# EAGLE design schema (EAGLE 8.0.2)
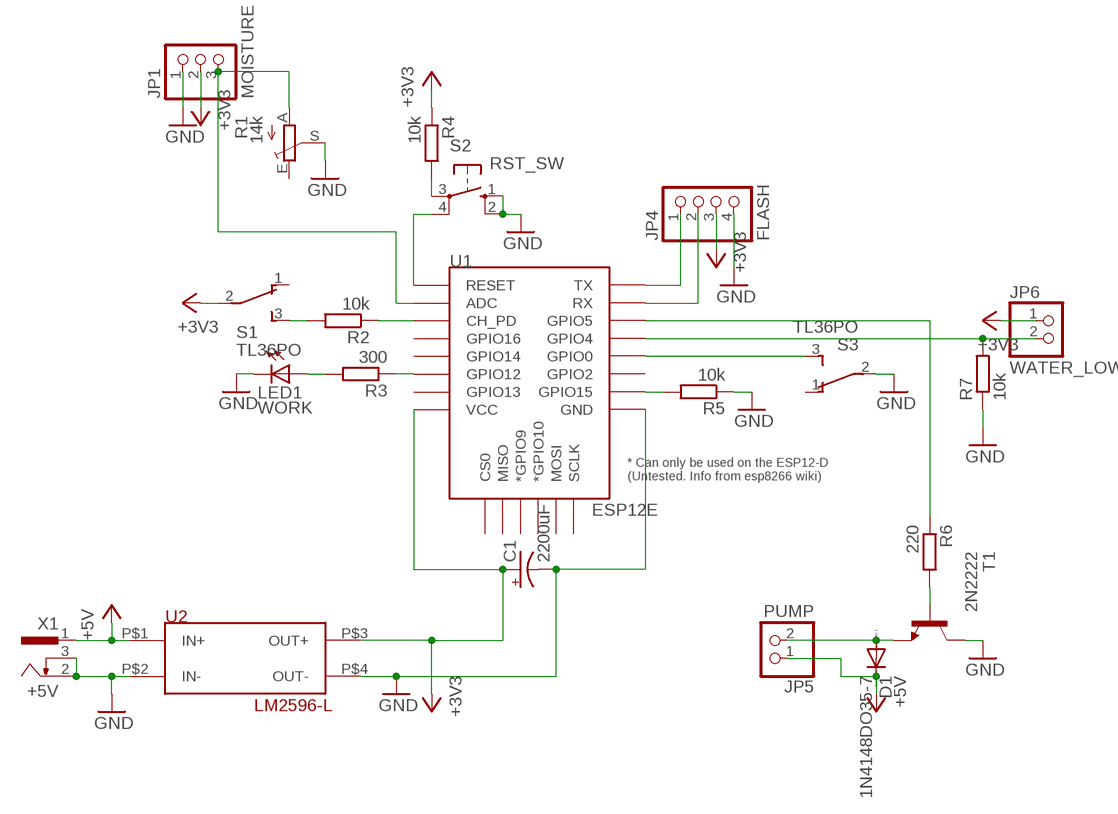
[diagram p0: schematic, sheet 1]

## Parts
C1  2200uF  100UF-25V-20%(PTH)  [CPOL-RADIAL-100UF-25V]
D1  1N4148DO35-7  [DO35-7]
JP1  MOISTURE  PINHD-1X3  [1X03]
JP4  FLASH  PINHD-1X4  [1X04]
JP5  PUMP  PINHD-1X2  [1X02]
JP6  WATER_LOW  PINHD-1X2  [1X02]
LED1  WORK  LED3MM  [LED3MM]
R1  14k  TRIM_EU-CA6V  [CA6V]
R2  10k  R-EU_0309/V  [0309V]
R3  300  R-EU_0309/V  [0309V]
R4  10k  R-EU_0309/V  [0309V]
R5  10k  R-EU_0309/V  [0309V]
R6  220  R-EU_0309/V  [0309V]
R7  10k  R-EU_0309/V  [0309V]
S1  TL36PO  [TL3XPO]
S2  RST_SW  10-XX  [B3F-10XX]
S3  TL36PO  [TL3XPO]
T1  2N2222  [TO18]
U1  ESP12E  ESP12ESMD  [ESP12E-SMD]
U2  LM2596-L  [LM2596-L]
X1  +5V  733989-5  [733989-5]

## Nets
+3V3: C1.1(+) JP1.2 JP4.3 JP6.1 R4.1 S1.2(P) U1.VCC U2.P$3(OUT+)
+5V: D1.C JP5.1 U2.P$1(IN+) X1.1
ADC: JP1.3 R1.A U1.ADC
CH_PD: R2.1 U1.CH_PD
CH_PD_S: R2.2 S1.3(S)
GND: C1.2(-) JP1.1 JP4.4 LED1.K(C) R1.S R5.1 R7.1 S2.1(S) S2.2(S1) S3.2(P) T1.3(C) U1.GND U2.P$2(IN-) U2.P$4(OUT-) X1.2 X1.3
GPIO0: S3.3(S) U1.GPIO0
GPIO4: JP6.2 R7.2 U1.GPIO4
GPIO5: R6.1 U1.GPIO5
GPIO5_T: R6.2 T1.2(B)
GPIO12: R3.1 U1.GPIO12
GPIO12D: LED1.A R3.2
GPIO15: R5.2 U1.GPIO15
PUMP_GND: D1.A JP5.2 T1.1(E)
RST: S2.4(P1) U1.RESET
RST_R: R4.2 S2.3(P)
RX: JP4.2 U1.RXD0(RX)
TX: JP4.1 U1.TXD0(TX)
Unconnected: R1.E S1.1(O) S3.1(O) U1.CS0 U1.GPIO2 U1.GPIO9(*GPIO9) U1.GPIO10(*GPIO10) U1.GPIO13 U1.GPIO14 U1.GPIO16 U1.MISO U1.MOSI U1.SCLK

## Library data of the parts
C1 = SparkFun-Capacitors:100UF-25V-20%(PTH): CAP-08439; PROD_ID: CAP-08439
D1 = diode:1N4148: DIODE high speed (Philips)
JP1 = pinhead:PINHD-1X3: PIN HEADER
JP4 = pinhead:PINHD-1X4: PIN HEADER
JP5 JP6 = pinhead:PINHD-1X2: PIN HEADER
LED1 = led:LED: LED OSRAM: - CHIPLED LG R971, LG N971, LY N971, LG Q971, LY Q971, LO R971, LY R971 LH N974, LH R974 LS Q976, LO Q976, LY Q976 LO Q996 - Hyper CHIPLED LW Q18S LB Q993, LB Q99A, LB R99A - SideLED LS A670, LO A670, LY A670, LG A670, LP A670 LB A673, LV A673, LT A673, LW A673 LH A674 LY A675 LS A676, LA A676, LO A676, LY A676, LW A676 LS A679, LY A679, LG A679 - Hyper Micro SIDELED® LS Y876, LA Y876, LO Y876, LY Y876 LT Y87S - SmartLED LW L88C, LW L88S LB L89C, LB L89S, LG L890 LS L89K, LO L89K, LY L89K LS L896, LA L896, LO L896, LY L896 - TOPLED LS T670, LO T670, LY T670, LG T670, LP T670 LSG T670, LSP T670, LSY T670, LOP T670, LYG T670 LG T671, LOG T671, LSG T671 LB T673, LV T673, LT T673, LW T673 LH T674 LS T676, LA T676, LO T676, LY T676, LB T676, LH T676, LSB T676, LW T676 LB T67C, LV T67C, LT T67C, LS T67K, LO T67K, LY T67K, LW E67C LS E67B, LA E67B, LO E67B, LY E67B, LB E67C, LV E67C, LT E67C LW T67C LS T679, LY T679, LG T679 LS T770, LO T770, LY T770, LG T770, LP T770 LB T773, LV T773, LT T773, LW T773 LH T774 LS E675, LA E675, LY E675, LS T675 LS T776, LA T776, LO T776, LY T776, LB T776 LHGB T686 LT T68C, LB T68C - Hyper Mini TOPLED® LB M676 - Mini TOPLED Santana® LG M470 LS M47K, LO M47K, LY M47K Source: http://www.osram.convergy.de LUXEON: - LUMILED® LXK2-PW12-R00, LXK2-PW12-S00, LXK2-PW14-U00, LXK2-PW14-V00 LXK2-PM12-R00, LXK2-PM12-S00, LXK2-PM14-U00 LXK2-PE12-Q00, LXK2-PE12-R00, LXK2-PE12-S00, LXK2-PE14-T00, LXK2-PE14-U00 LXK2-PB12-K00, LXK2-PB12-L00, LXK2-PB12-M00, LXK2-PB14-N00, LXK2-PB14-P00, LXK2-PB14-Q00 LXK2-PR12-L00, LXK2-PR12-M00, LXK2-PR14-Q00, LXK2-PR14-R00 LXK2-PD12-Q00, LXK2-PD12-R00, LXK2-PD12-S00 LXK2-PH12-R00, LXK2-PH12-S00 LXK2-PL12-P00, LXK2-PL12-Q00, LXK2-PL12-R00 Source: www.luxeon.com KINGBRIGHT: KA-3528ASYC Source: www.kingbright.com
R1 = pot:TRIM_EU-: POTENTIOMETER
R2-R7 = resistor:R-EU_: RESISTOR, European symbol
S1 S3 = switch:TL36PO: TINY SWITCH ON - ON Source: http://www2.produktinfo.conrad.com/datenblaetter/700000-724999/705152-da-01-de-Subminiaturschalter_TL_36YO.pdf
S2 = switch-omron:10-XX: OMRON SWITCH; MPN: B3F-1000; OC_FARNELL: 176432; OC_NEWARK: 36M3542
T1 = transistor:2N2222: NPN TRANSISTOR
U1 = esp8266modules:ESP12E: ESP12E Module
U2 = hi-link:LM2596-L
X1 = con-conrad:73398?: FEMALE PRINT CONNECTOR Niedervolt-Steckverbinder Distributor Conrad

## Board
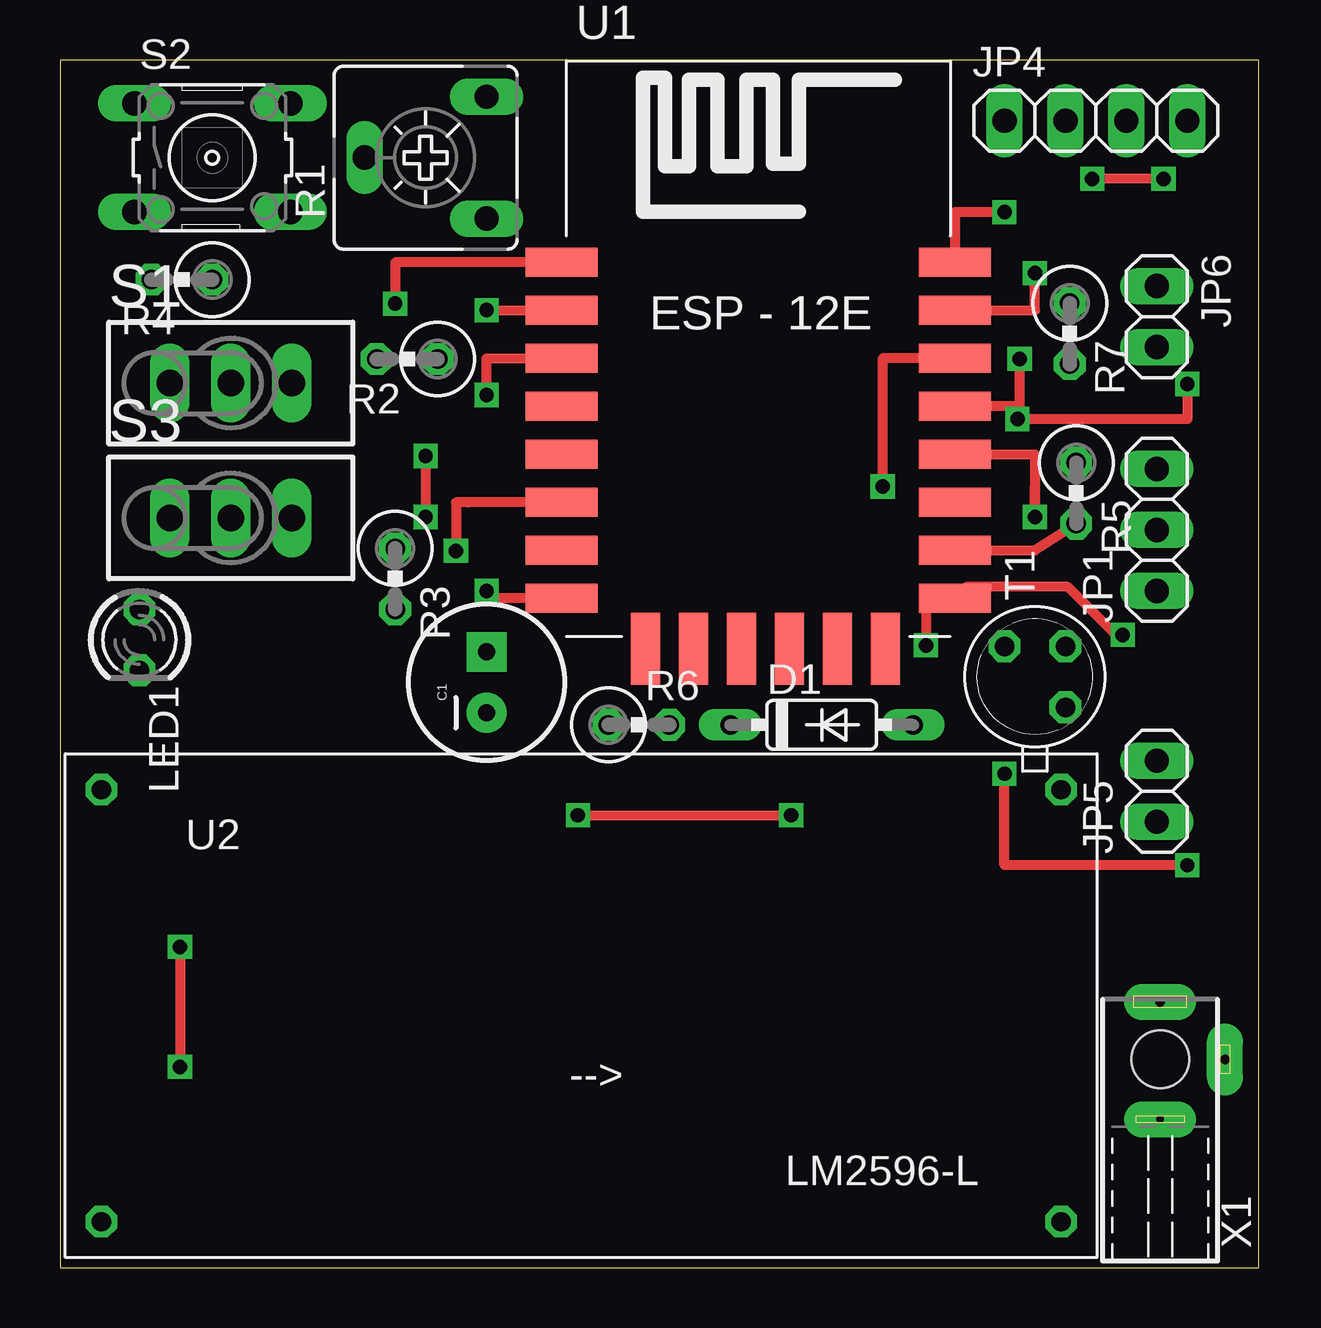
[diagram p1: board, top side]
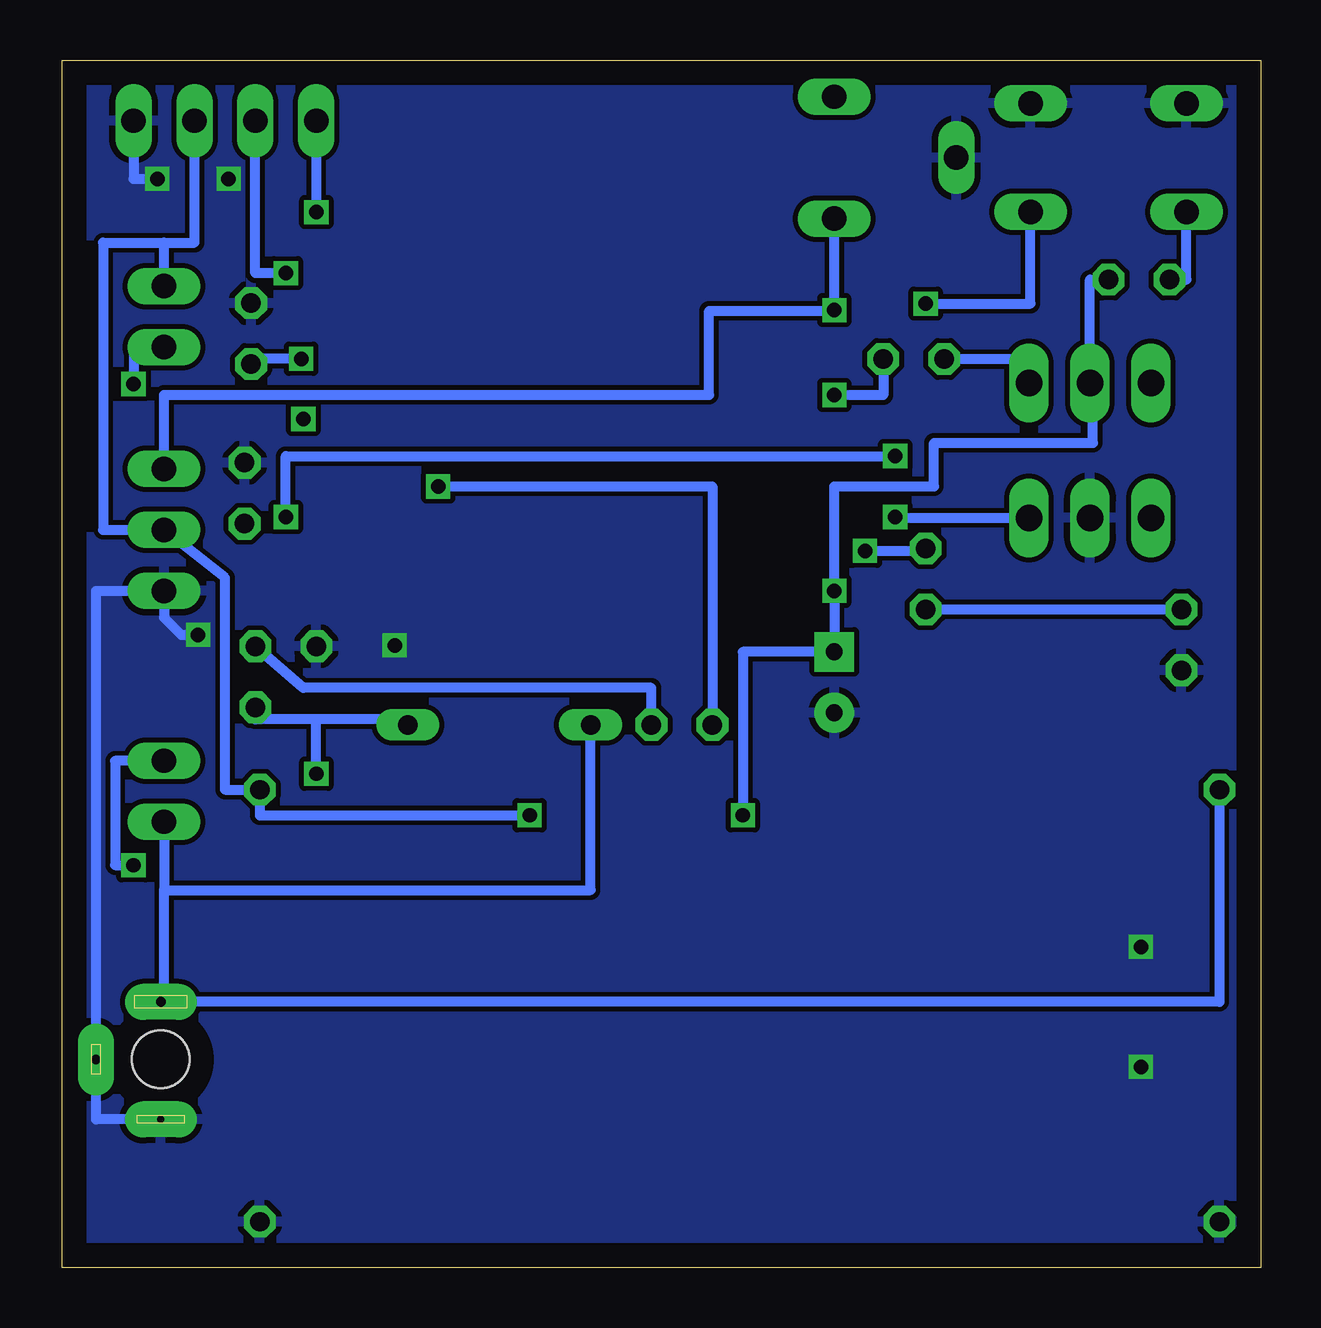
[diagram p2: board, bottom side, seen from below]

Size 49.97 x 50.33 mm. Coordinates in mm from the lower left corner, seen from the top.
Outline: 0,0 49.97,0 49.97,50.33 0,50.33 0,0
Copper layers (1*16): Top 0.035mm / dielectric 1.5mm / Bottom 0.035mm
Design rules "default": minimum track width 10mil, minimum drill 24mil, track to track 8mil, track to pad 8mil, pad to pad 8mil, via to via 8mil, smd to smd 8mil, copper to edge 40mil, drill to drill 8mil, minimum pad ring 10mil, minimum via ring 8mil, stop-mask expansion 4mil, vias tented up to drill 0mil, thermal gap 10mil

### Footprints (pad centres in the part's own frame; a part is rotated, then mirrored left to right if it is on the bottom)
CPOL-RADIAL-100UF-25V = drill 0.7 pad 1.651 square: 1 1.27,0 | drill 0.7 pad 1.651: 2 -1.27,0
DO35-7 = drill 0.813 long: A 3.81,0; C -3.81,0
1X03 = drill 1.016 long: 1 -2.54,0; 2 0,0; 3 2.54,0
1X04 = drill 1.016 long: 1 -3.81,0; 2 -1.27,0; 3 1.27,0; 4 3.81,0
1X02 = drill 1.016 long: 1 -1.27,0; 2 1.27,0
LED3MM = drill 0.813 octagon: A -1.27,0; K 1.27,0
CA6V = drill 1.016 long: A -2.54,-2.54; E 2.54,-2.54; S 0,2.54
0309V = drill 0.813 octagon: 1 -1.27,0; 2 1.27,0
TL3XPO = drill 1.1 pad 1.422 long: 1 -2.54,0; 2 0,0; 3 2.54,0
B3F-10XX = drill 1.016 long: 1 -3.251,2.261; 2 3.251,2.261; 3 -3.251,-2.261; 4 3.251,-2.261
TO18 = drill 0.813 octagon: 1 -1.27,-1.27; 2 1.27,-1.27; 3 1.27,1.27
ESP12E-SMD = smd 3 x 1.2: ADC -8.3,3.8; CH_PD -8.3,1.8; GND 8.1,-8.2; GPIO0 8.1,-2.2; GPIO2 8.1,-4.2; GPIO4 8.1,-0.2; GPIO5 8.1,1.8; GPIO12 -8.3,-4.2; GPIO13 -8.3,-6.2; GPIO14 -8.3,-2.2; GPIO15 8.1,-6.2; GPIO16 -8.3,-0.2; RESET -8.3,5.8; RXD0 8.1,3.8; TXD0 8.1,5.8; VCC -8.3,-8.2 | smd 1.2 x 3: CS0 -4.8,-10.3; GPIO9 -0.8,-10.3; GPIO10 1.2,-10.3; MISO -2.8,-10.3; MOSI 3.2,-10.3; SCLK 5.2,-10.3
LM2596-L = drill 0.8 octagon: P$1 -20.5,8.5; P$2 -20.5,-9.5; P$3 19.5,8.5; P$4 19.5,-9.5
733989-5 = drill 0.4 pad 1.5 long: 1 0,5.82; 3 2.7,3.42 | drill 0.3 pad 1.5 long: 2 0,0.92 | hole 2.4: 0,3.42

### Placement (x,y rotation side)
C1  17.78,24.4 90 top
D1  31.75,22.63 0 top
JP1  45.72,30.75 90 top
JP4  43.18,47.8 0 top
JP5  45.72,19.86 90 top
JP6  45.72,39.64 270 top
LED1  3.31,26.17 270 top
R1  15.24,46.26 90 top
R2  14.47,37.87 180 top
R3  13.97,28.71 270 top
R4  5.08,41.18 180 top
R5  42.36,32.28 270 top
R6  24.13,22.63 0 top
R7  42.09,38.93 270 top
S1  7.12,36.87 0 top
S2  6.35,46.26 0 top
S3  7.12,31.25 0 top
T1  40.64,24.63 90 top
U1  29.21,36.1 0 top
U2  22.23,11.43 0 top
X1  45.85,5.27 0 top

### Tracks (layer width: path | path; a pad name or v marks a point on that pad's centre or on a via)
+3V3  (via drill 0.6)
  Top 0.406: U1.VCC 17.78,27.9 v17.78,28.21 | v21.59,18.86 v30.48,18.86
  Bottom 0.406: 45.72,42.72 48.26,42.72 48.26,30.75 JP1.2 43.18,28.75 43.18,19.93 U2.P$3 41.73,18.86 v30.48,18.86 | JP6.1 45.72,42.72 | 45.72,42.72 44.45,42.72 JP4.3 | R4.1 7.12,41.18 S1.2 7,36.87 7,34.38 13.62,34.38 13.62,32.56 17.78,32.56 v17.78,28.21 C1.1 21.59,25.67 v21.59,18.86
+5V
  Bottom 0.406: 46.99,18.59 JP5.1 45.72,15.74 | U2.P$1 1.73,11.09 45.72,11.09 | X1.1 45.72,11.09 | 45.72,11.09 45.72,15.74 | 45.72,15.74 27.94,15.74 D1.C
ADC  (via drill 0.6)
  Top 0.406: v17.78,39.91 v17.78,39.9 U1.ADC
  Bottom 0.406: R1.A v17.78,39.91 17.78,39.88 23,39.88 23,36.38 45.72,36.38 JP1.3
CH_PD  (via drill 0.6)
  Top 0.406: v17.78,36.37 17.78,37.9 U1.CH_PD
  Bottom 0.406: R2.1 15.74,36.37 v17.78,36.37
CH_PD_S
  Bottom 0.406: S1.3 9.66,37.87 R2.2
GND  (via drill 0.6)
  Top 0.406: v36.1,25.94 36.1,27.9 U1.GND 37.79,28.38 42,28.38 44,26.38 v44.3,26.38 | v46,45.38 v43.03,45.38 | v43.03,45.38 43,45.38 v43.03,45.38 | v5,13.38 v5,8.38
  Bottom 0.406: X1.2 48.55,6.19 X1.3 48.55,28.21 JP1.1 45.72,27.1 45,26.38 v44.3,26.38 | JP4.4 46.99,45.38 v46,45.38
  pour Bottom: -3.81,52.88 53.34,52.88 53.34,-6.81 -3.81,-6.81
GPIO0  (via drill 0.6)
  Top 0.406: 40.64,32.56 v40.64,31.29 40.64,33.9 U1.GPIO0 | v15.24,33.83 v15.24,31.29
  Bottom 0.406: v40.64,31.29 40.64,33.83 v15.24,33.83 | v15.24,31.29 15.24,31.25 S3.3
GPIO4  (via drill 0.6)
  Top 0.406: v39.91,35.37 39.91,35.9 | 39.91,35.9 U1.GPIO4 | v39.91,35.37 v39.91,35.38 | v47,36.83 v46.99,36.83 46.99,35.37 v39.91,35.37 | 39.91,35.9 arc90 40,35.99 v40,37.88
  Bottom 0.406: v46.99,36.83 46.99,38.37 JP6.2 | v40,37.88 41.87,37.88 arc-90 R7.2
GPIO5  (via drill 0.6)
  Top 0.406: U1.GPIO5 34.29,37.9 v34.29,32.56
  Bottom 0.406: v34.29,32.56 22.86,32.56 R6.1
GPIO5_T
  Bottom 0.406: R6.2 25.4,24.17 39.91,24.17 T1.2
GPIO12  (via drill 0.6)
  Top 0.406: U1.GPIO12 17,31.9 | 17,31.9 16.5,31.9 | 17,31.9 16.5,31.9 | 16.5,31.9 v16.5,29.88
  Bottom 0.406: v16.5,29.88 13.97,29.88 R3.1
GPIO12D
  Bottom 0.406: R3.2 LED1.A
GPIO15
  Top 0.406: U1.GPIO15 40.64,29.9 R5.2
PUMP_GND  (via drill 0.6)
  Top 0.406: v46.99,16.78 39.37,16.78 v39.37,20.59
  Bottom 0.406: D1.A 35.56,22.86 39.37,22.86 | JP5.2 47.76,21.13 47.76,16.78 v46.99,16.78 | v39.37,20.59 39.37,22.86 | 39.37,22.86 41.91,22.86 T1.1
RST  (via drill 0.6)
  Top 0.406: U1.RESET 13.97,41.9 v13.97,40.18
  Bottom 0.406: v13.97,40.18 9.6,40.18 S2.4
RST_R
  Bottom 0.406: R4.2 3.1,41.18 S2.3
RX  (via drill 0.6)
  Top 0.406: U1.RXD0 40.64,39.9 v40.64,41.45
  Bottom 0.406: v40.64,41.45 41.91,41.45 JP4.2
TX  (via drill 0.6)
  Top 0.406: v39.37,43.99 37.31,43.99 U1.TXD0
  Bottom 0.406: JP4.1 v39.37,43.99